# EAGLE schematic Robomow PCG5002E schematic (EAGLE 9.6.2)
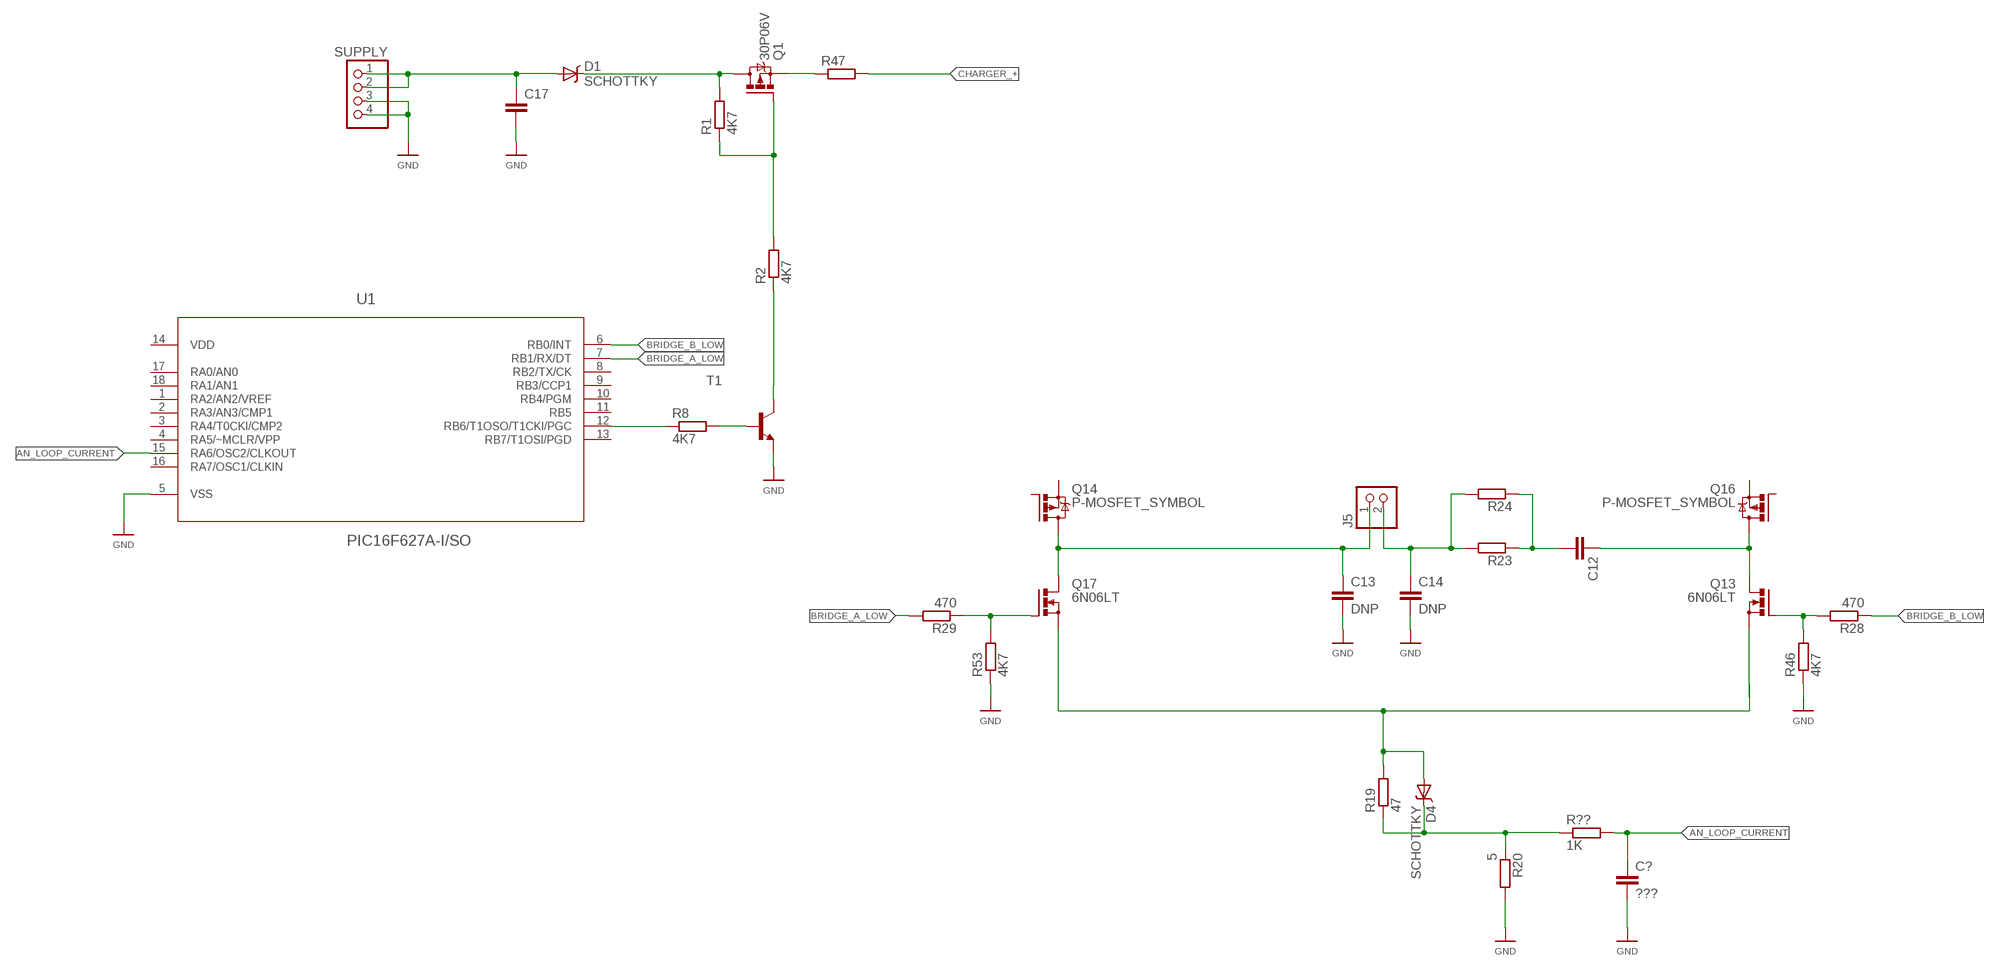
[diagram p0: schematic, sheet 1]

## Parts
C12  C-EU050-030X075  [C050-030X075]
C13  DNP  C-EUC0603  [C0603]
C14  DNP  C-EUC0603  [C0603]
C17  C-EU050-030X075  [C050-030X075]
C?  ???  C-EUC0603  [C0603]
D1  SCHOTTKY  [DO-214AC]
D4  SCHOTTKY  [DO-214AC]
J5  PINHD-1X2  [1X02]
R1  4K7  R-EU_R0603  [R0603]
R2  4K7  R-EU_R0603  [R0603]
R8  4K7  R-EU_R0603  [R0603]
R19  47  R-EU_R0603  [R0603]
R20  5  R-EU_R0603  [R0603]
R23  R-EU_0414/15  [0414/15]
R24  R-EU_0414/15  [0414/15]
R28  470  R-EU_R0603  [R0603]
R29  470  R-EU_R0603  [R0603]
R46  4K7  R-EU_R0603  [R0603]
R47  R-EU_0414/15  [0414/15]
R53  4K7  R-EU_R0603  [R0603]
R??  1K  R-EU_R0603  [R0603]
SUPPLY  PINHD-1X4  [1X04]
T1  -NPN-SOT23-EBC  [SOT23-EBC]
U1  PIC16F627A-I/SO  [SOIC127P1030X265-18N]

## Nets
AN_LOOP_CURRENT: C?.1 R??.2 U1.15(RA6/OSC2/CLKOUT)
BRIDGE_A_LOW: R29.2 U1.7(RB1/RX/DT)
BRIDGE_B_LOW: R28.1 U1.6(RB0/INT)
CHARGER_+: R47.2
GND: C13.2 C14.2 C17.2 C?.2 R20.2 R46.1 R53.1 SUPPLY.3 SUPPLY.4 T1.E U1.5(VSS)
N$1: R8.1 U1.12(RB6/T1OSO/T1CKI/PGC)
N$2: R8.2 T1.B
N$3: D1.C R1.2
N$4: R1.1 R2.2
N$5: C17.1 D1.A SUPPLY.1 SUPPLY.2
N$6: R2.1 T1.C
N$7: R47.1
N$8: R29.1 R53.2
N$10: C13.1 J5.1
N$11: C12.2 R23.1 R24.1
N$12: R28.2 R46.2
N$13: D4.A R19.2
N$14: C14.1 J5.2 R23.2 R24.2
N$15: C12.1
N$16: D4.C R19.1 R20.1 R??.1
Unconnected: U1.1(RA2/AN2/VREF) U1.2(RA3/AN3/CMP1) U1.3(RA4/T0CKI/CMP2) U1.4(RA5/~MCLR/VPP) U1.8(RB2/TX/CK) U1.9(RB3/CCP1) U1.10(RB4/PGM) U1.11(RB5) U1.13(RB7/T1OSI/PGD) U1.16(RA7/OSC1/CLKIN) U1.17(RA0/AN0) U1.18(RA1/AN1)

## Power pins joined to a net without a drawn wire
VDD: U1.14(VDD)

## Library data of the parts
C12-C14 C17 C? = rcl:C-EU: CAPACITOR, European symbol
D1 D4 = Ava2:SCHOTTKY
J5 = pinhead:PINHD-1X2: PIN HEADER
R1 R2 R8 R19 R20 R23 R24 R28 R29 R46 R47 R53 R?? = rcl:R-EU_: RESISTOR, European symbol
SUPPLY = pinhead:PINHD-1X4: PIN HEADER
T1 = transistor:*-NPN-: NPN Transistror BF959 corrected 2008.03.06
U1 = Microchip_By_element14_Batch_1:PIC16F627A-I/SO: 8 Bit CMOS Microcontrollers; DESCRIPTION: 8 Bit CMOS Microcontrollers; MPN: PIC16F627A-I/SO; OC_FARNELL: 1660014; OC_NEWARK: 60K6712; PACKAGE: SOIC-18; SUPPLIER: Microchip